# Altium schematic sheet Schematic.SchDoc
size C
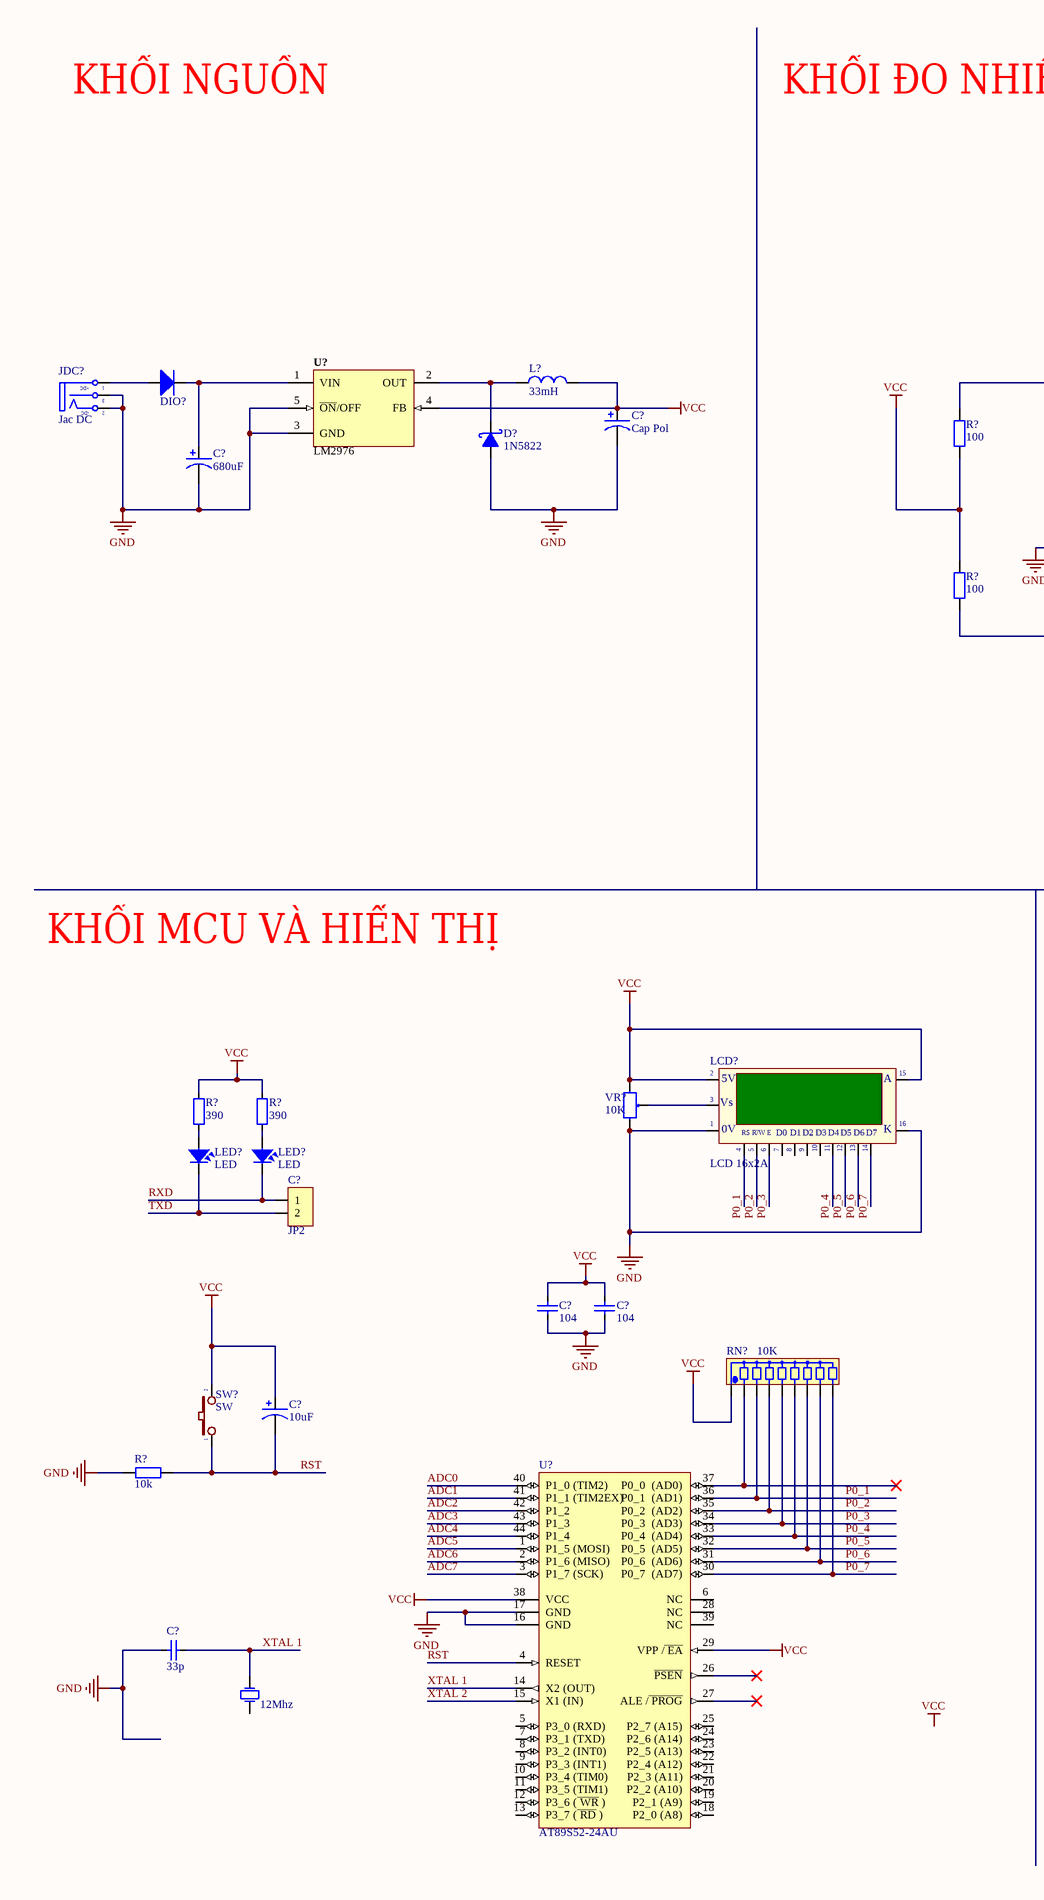
[diagram p0: Schematic.SchDoc, left]
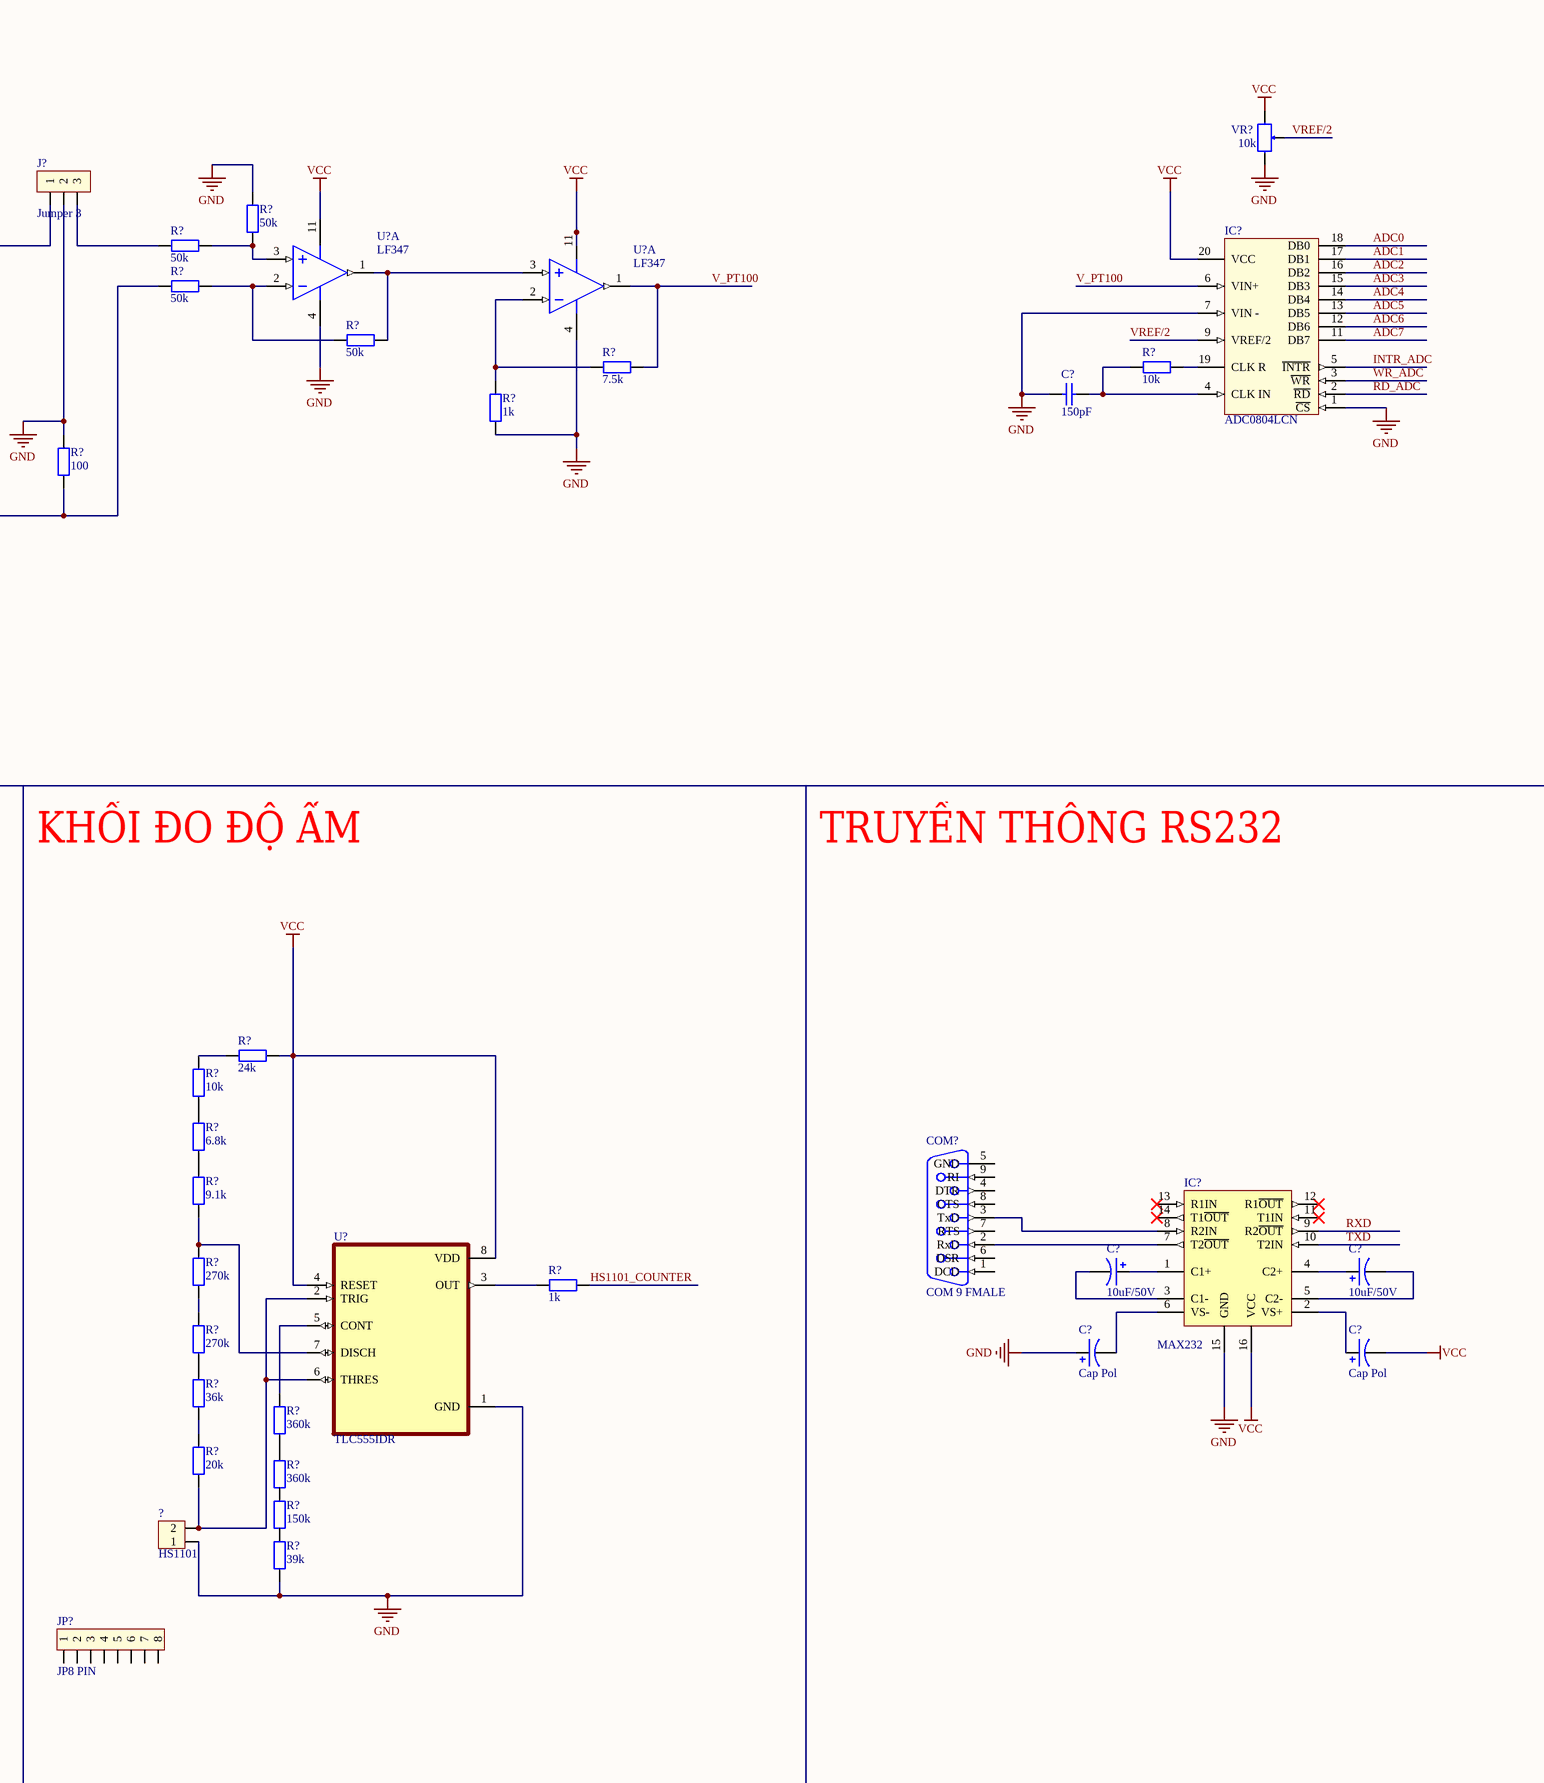
[diagram p1: Schematic.SchDoc, right]

## Parts
(Parts that share a designator on the sheet are numbered #1, #2 ... from top to bottom, then left to right.)
?  HS1101  [CON2]
C?#1  Cap Pol  [C3MM]
C?#2  680uF  [C3MM]
C?#3  150pF  [tu 0805]
C?#4  JP2  [JP2-C1T]
C?#5  104  [CAP_0805]
C?#6  104  [CAP_0805]
C?#7  10uF/50V  [C3MM]
C?#8  10uF/50V  [C3MM]
C?#9  10uF  [C3MM]
C?#10  Cap Pol  [C3MM]
C?#11  Cap Pol  [C3MM]
C?#12  33p  [CAP_0402]
COM?  COM 9 FMALE  [COM9B]
D?  1N5822  [SMA]
DIO?  Diode SMD  [DIO-SMD-106]  (value not drawn)
IC?#1  ADC0804LCN  [DIP20/W0.3]
IC?#2  MAX232  [DIP16/W0.3]
J?  Jumper 3  [JP3]
JDC?  Jac DC  [DC-IN]
JP?  JP8 PIN  [JP8]
L?  33mH  [L-SMD-M-12x10]
LCD?  LCD 16x2A  [LCD16X2]
LED?#1  LED  [LED-0805-Blue]
LED?#2  LED  [LED-0805-Green]
R?#1  50k  [Tro SMD 0805]
R?#2  50k  [Tro SMD 0805]
R?#3  50k  [Tro SMD 0805]
R?#4  100  [Tro SMD 0805]
R?#5  50k  [Tro SMD 0805]
R?#6  7.5k  [Tro SMD 0805]
R?#7  10k  [tro smd 0805]
R?#8  1k  [Tro SMD 0805]
R?#9  100  [Tro SMD 0805]
R?#10  100  [Tro SMD 0805]
R?#11  390  [RES-SMD-0805]
R?#12  390  [RES-SMD-0805]
R?#13  24k  [RES-SMD-0101]
R?#14  10k  [RES-SMD-0101]
R?#15  6.8k  [RES-SMD-0101]
R?#16  9.1k  [RES-SMD-0101]
R?#17  270k  [RES-SMD-0101]
R?#18  1k  [tro smd 0805]
R?#19  270k  [RES-SMD-0101]
R?#20  36k  [Tro SMD 0805]
R?#21  10k  [RES-SMD-0101]
R?#22  360k  [tro smd 0805]
R?#23  20k  [RES-SMD-0101]
R?#24  360k  [RES-SMD-0101]
R?#25  150k  [RES-SMD-0101]
R?#26  39k  [RES-SMD-0101]
RN?  10K  [RN8]
SW?  SW  [SW2]
U?#1  LM2976  [TO263]
U?#2  LF347  [DIP.100/8/W.300/L.400]  (part A of 4)
U?#3  LF347  [DIP.100/8/W.300/L.400]  (part A of 4)
U?#4  TLC555IDR  [SOIC127P599X175-8N]
U?#5  AT89S52-24AU  [TQFP44-0.8-9.6X9.6MM]
VR?#1  10k  [VAR_RESISTOR]
VR?#2  10K  [VR]
Y?  12Mhz  [XTAL]

## Nets
GND: ?.1 C?#1.2 C?#2.2 C?#3.2 C?#5.1 C?#6.1 C?#10.1 C?#12.2 D?.1(A) IC?#1.1(~{CS}) IC?#1.7(VIN_-) IC?#1.8(AGND) IC?#1.10(DGND) IC?#2.15(GND) J?.2 JDC?.2(TN) JDC?.3(S) LCD?.1(GND) LCD?.16(K) R?#1.2 R?#8.1 R?#10.2 R?#21.1 R?#26.2 U?#1.3(GND) U?#1.5(~{ON}/OFF) U?#2.4(VCC) U?#3.4(VCC) U?#4.1(GND) U?#5.16(GND) U?#5.17(GND) VR?#1.3 VR?#2.3
VCC: C?#1.1 C?#5.2 C?#6.2 C?#9.1 C?#11.2 IC?#1.20(VCC) IC?#2.16(VCC) L?.2 LCD?.2(VDD) LCD?.15(A) R?#4.1 R?#9.2 R?#11.2 R?#12.2 R?#13.1 RN?.1 SW?.2 U?#1.4(FB) U?#2.11(VEE) U?#3.11(VEE) U?#4.4(RESET) U?#4.8(VDD) U?#5.29(VPP_/~{_EA}) U?#5.38(VCC) VR?#1.1 VR?#2.1
ADC0: IC?#1.18(DB0) U?#5.40(P1_0_(TIM2))
ADC1: IC?#1.17(DB1) U?#5.41(P1_1_(TIM2EX))
ADC2: IC?#1.16(DB2) U?#5.42(P1_2)
ADC3: IC?#1.15(DB3) U?#5.43(P1_3)
ADC4: IC?#1.14(DB4) U?#5.44(P1_4)
ADC5: IC?#1.13(DB5) U?#5.1(P1_5_(MOSI))
ADC6: IC?#1.12(DB6) U?#5.2(P1_6_(MISO))
ADC7: IC?#1.11(DB7) U?#5.3(P1_7_(SCK))
HS1101_COUNTER: R?#18.2
INTR_ADC: IC?#1.5(~{INTR})
P0_1: RN?.3 U?#5.36(P0_1__(AD1))
P0_2: RN?.4 U?#5.35(P0_2__(AD2))
P0_3: RN?.5 U?#5.34(P0_3__(AD3))
P0_4: RN?.6 U?#5.33(P0_4__(AD4))
P0_5: RN?.7 U?#5.32(P0_5__(AD5))
P0_6: RN?.8 U?#5.31(P0_6__(AD6))
P0_7: RN?.9 U?#5.30(P0_7__(AD7))
RD_ADC: IC?#1.2(~{RD})
RST: C?#9.2 R?#21.2 SW?.1 U?#5.4(RESET)
RXD: C?#4.1 IC?#2.9(R2~{OUT}) LED?#2.2
TXD: C?#4.2 IC?#2.10(T2IN) LED?#1.2
V_PT100: IC?#1.6(VIN+) R?#6.1 U?#3.1(1_OUT)
VREF/2: IC?#1.9(VREF/2) VR?#1.2
WR_ADC: IC?#1.3(~{WR})
XTAL 1: C?#12.1 U?#5.14(X2_(OUT)) Y?.2(OSC2)
XTAL 2: U?#5.15(X1_(IN))
Net?_2: ?.2 R?#23.2 U?#4.2(TRIG) U?#4.6(THRES)
NetC?#2_1: C?#2.1 DIO?.2(K) U?#1.1(VIN)
NetC?#3_1: C?#3.1 IC?#1.4(CLK_IN) R?#7.1
NetC?#7_1: C?#7.1 IC?#2.1(C1+)
NetC?#7_2: C?#7.2 IC?#2.3(C1-)
NetC?#8_1: C?#8.1 IC?#2.4(C2+)
NetC?#8_2: C?#8.2 IC?#2.5(C2-)
NetC?#10_2: C?#10.2 IC?#2.6(VS-)
NetC?#11_1: C?#11.1 IC?#2.2(VS+)
NetCOM?_2: COM?.2(RxD) IC?#2.7(T2~{OUT})
NetCOM?_3: COM?.3(TxD) IC?#2.8(R2IN)
NetD?_2: D?.2(K) L?.1 U?#1.2(OUT)
NetDIO?_1: DIO?.1(A) JDC?.1(T)
NetIC?#1_19: IC?#1.19(CLK_R) R?#7.2
NetJ?_1: J?.1 R?#4.2
NetJ?_3: J?.3 R?#2.1
NetLCD?_3: LCD?.3(VEE) VR?#2.2
NetLED?#1_1: LED?#1.1 R?#11.1
NetLED?#2_1: LED?#2.1 R?#12.1
NetR?#1_1: R?#1.1 R?#2.2 U?#2.3(1_IN+)
NetR?#3_1: R?#3.1 R?#9.1 R?#10.1
NetR?#3_2: R?#3.2 R?#5.1 U?#2.2(1_IN-)
NetR?#5_2: R?#5.2 U?#2.1(1_OUT) U?#3.3(1_IN+)
NetR?#6_2: R?#6.2 R?#8.2 U?#3.2(1_IN-)
NetR?#13_2: R?#13.2 R?#14.1
NetR?#14_2: R?#14.2 R?#15.1
NetR?#15_2: R?#15.2 R?#16.1
NetR?#16_2: R?#16.2 R?#17.1 U?#4.7(DISCH)
NetR?#17_2: R?#17.2 R?#19.1
NetR?#18_1: R?#18.1 U?#4.3(OUT)
NetR?#19_2: R?#19.2 R?#20.2
NetR?#20_1: R?#20.1 R?#23.1
NetR?#22_1: R?#22.1 R?#24.1
NetR?#22_2: R?#22.2 U?#4.5(CONT)
NetRN?_2: RN?.2 U?#5.37(P0_0__(AD0))

Not connected (* = marked no-connect by the designer): COM? 1(DCD) 4(DTR) 5(GND) 6(DSR) 7(RTS) 8(CTS) 9(RI) 10(MH1) 11(MH2); IC?#2 11(T1IN)* 12(R1~{OUT})* 13(R1IN)* 14(T1~{OUT})*; JP? 1 2 3 4 5 6 7 8; LCD? 4(RS) 5(R/~{W}) 6(~{EN}) 7(D0) 8(D1) 9(D2) 10(D3) 11(D4) 12(D5) 13(D6) 14(D7); R?#24 2; R?#25 1 2; R?#26 1; U?#5 5(P3_0_(RXD)) 6(NC) 7(P3_1_(TXD)) 8(P3_2_(INT0)) 9(P3_3_(INT1)) 10(P3_4_(TIM0)) 11(P3_5_(TIM1)) 12(P3_6_(~{_WR}_)) 13(P3_7_(~{_RD}_)) 18(P2_0_(A8)) 19(P2_1_(A9)) 20(P2_2_(A10)) 21(P2_3_(A11)) 22(P2_4_(A12)) 23(P2_5_(A13)) 24(P2_6_(A14)) 25(P2_7_(A15)) 26(~{PSEN})* 27(ALE_/~{_PROG})* 28(NC) 39(NC); Y? 1(OSC1)

## Notes on the sheet
- KHỐI NGUỒN
- KHỐI ĐO NHIỆT ĐỘ
- KHỐI MCU VÀ HIỂN THỊ
- KHỐI ĐO ĐỘ ẨM
- TRUYỀN THÔNG RS232
- Labels drawn without touching a wire or pin: P0_1, P0_2, P0_3, P0_4, P0_5, P0_6, P0_7, VCC
- (in symbol DCIN) +DC; -DC
- (in symbol LCD16x2A) 5V; Vs; |; 0V; R/W; E

## Library data of the parts
? = Con2: Connector 2; Value: Connector 2
C?#1 C?#2 C?#7-C?#11 = Cap Pol: Polarized Capacitor (Axial); Published: 8-Jun-2000; LatestRevisionDate: 17-Jul-2002; LatestRevisionNote: Re-released for DXP Platform.; PackageReference: POLAR0.8; Publisher: Altium Limited
C?#3 = Tu 0805 220nF 50V 10%: Dán; Don_Vi: Con; So_Chan: 2; Ten_Linh_Kien: Tụ 0805 220nF 50V 10%; Ma_Hang: MH008099; Chung_Loai: Dán; Kieu_Chan: *
C?#4 = JP2: WR-PHD 2.54 mm Angled Socket Header; Manufacturer: W¨¹rth Elektronik eiSos GmbH; partNo: 613002143121; ComponentLink1 Description: Manufacturer; ComponentLink2 Description: Datasheet; NoPins: 02; Created Date: 29 March 2013; ComponentLink1URL: http://www.we-online.com; ComponentLink2URL: http://katalog.we-online.de/em/datasheet/6130xx143121.pdf; Created by: Karrer Zheng
C?#5 C?#6 = CapSMD: Capacitor; Value: 33p; Published: 8-Jun-2000; LatestRevisionDate: 17-Jul-2002; LatestRevisionNote: Re-released for DXP Platform.; PackageReference: RAD-0.3; Publisher: Altium Limited
C?#12 = CapSMD: Capacitor; Published: 8-Jun-2000; LatestRevisionDate: 17-Jul-2002; LatestRevisionNote: Re-released for DXP Platform.; PackageReference: RAD-0.3; Publisher: Altium Limited; Value: 33p
COM? = COM9F: COM 9; PackageDocument: O; Positions: 9; Gender: Receptacle; Value: COM 9; Published: 15-Jun-2001; LatestRevisionDate: 17-Jul-2002; LatestRevisionNote: Re-released for DXP Platform.; DatasheetDocument: 1-Sep-1999; PackageReference: 788750; Publisher: Altium Limited; Orientation: Right Angle
D? = 1N5822: Schottky Rectifiers; Value: Diode c?m 1N5408
DIO? = Diode SMD: Default Diode; Code - JEDEC: DO-214-AB; Value: 1N5007; Published: 8-Jun-2000; Revision: July-2002: Re-released for DXP Platform.; Publisher: Altium Limited
IC?#1 = ADC0804: Cắm; Ten_Linh_Kien: ADC0804LCN DIP20; Don_Vi: Con; Ma_Hang: MH002626; Ghi_Chu: *; Kieu_Chan: *; Chung_Loai: Cắm
IC?#2 = MAX232: Dual EIA-232 Driver/Receiver; Value: MAX232
J? = JP3: Value: J3
JDC? = DCIN: Jac DC input; Value: Jac DC
JP? = JP8: Value: JP7
L? = Inductor: Value: 150 mH
LCD? = LCD16x2A: LCD dipslay 16 char, 2 line; Value: LCD16x2A
LED?#1 LED?#2 = LED: LED Single colour Green and Red; Value: LED 3 ly Single Colour
R?#1-R?#6 R?#8-R?#10 = Tro 0805 5% 82k: Dán; Don_Vi: Con; So_Chan: 2; Ten_Linh_Kien: Trở 0805 5% 82k; Ma_Hang: MH005329; Chung_Loai: Dán; Kieu_Chan: *
R?#7 = Tro 0805 5% 10k: Dán; Don_Vi: Con; So_Chan: 2; Ten_Linh_Kien: Trở 0805 5% 10k; Ma_Hang: MH005239; Chung_Loai: Dán; Kieu_Chan: *
R?#11 R?#12 = Resistor - SMD: Resistor; Manufacturer: Generic Components; Class: Passive; Published: 08/06/2000; Publisher: Altium Hobart Technology Centre
R?#13-R?#17 R?#19 R?#21 R?#23-R?#26 = Resistor - SMD: Resistor SMD; Manufacturer: Generic Components; Class: Passive; Published: 08/06/2000; Publisher: Altium Hobart Technology Centre
R?#18 = Tro 0805 1% 1k: Dán; Don_Vi: Con; So_Chan: 2; Ten_Linh_Kien: Trở 0805 1% 1k; Ma_Hang: MH005468; Chung_Loai: Dán; Kieu_Chan: *
R?#20 = Tro 0805 5% 510k: Dán; Don_Vi: Con; Ma_Hang: MH007566; Ten_Linh_Kien: Trở 0805 5% 510k; So_Chan: 2; Chung_Loai: Dán; Kieu_Chan: *
R?#22 = Tro 0805 5% 1M: Dán; Don_Vi: Con; So_Chan: 2; Ten_Linh_Kien: Trở 0805 5% 1M; Ma_Hang: MH005235; Chung_Loai: Dán; Kieu_Chan: *
RN? = RN8: Resistor 8 (Thanh); Value: Tro thanh 10K
SW? = SW2: Switch button 2 pin; Value: SW chip 2 pin
U?#1 = LM2596: Max Input Voltage: 12 V; Max Output Current: 3 (6.0 peak) A; Max Output Voltage: mV; Category: IC-Power; Min Input Voltage: mV; Min Output Voltage: mV; Mounting Technology: Surface Mount; Status: Unreleased; Supply Voltage: mV; Temperature Range: -40 to +125 degC
U?#2 U?#3 = LF347: Low Power Quad Operational Amplifier; Manufacturer Part Number: LF347BD; Manufacturer: Texas Instruments; Text Field1: pristel=Nsc\nsanopea\<parttype>.ckt; Slew Rate: 13 V/µs; Voltage - Supply, Single/Dual (±): 7 V ~ 36 V, ±3.5 V ~ 18 V; Current - Input Bias: 50pA; Voltage - Input Offset: 3000µV; Number of Circuits: 4; Gain Bandwidth Product: 3MHz; Amplifier Type: J-FET; Current - Supply: 8mA; Supplier 1: Digi-Key; Supplier Part Number 1: 296-7136-5-ND; Package / Case: 14-SOIC (3.9mm Width), 14-SOL; Supplier: Digi-Key; Current - Output / Channel: -; Packaging: Tube; RoHS: RoHS Compliant; Output Type: -; Operating Temperature: 0°C ~ 70°C; Category: Integrated Circuits (ICs); Supplier Part Number: 296-7136-5-ND
U?#4 = TLC555IDR: 2.1-MHz, 250-A, Low-Power Timer 8-SOIC -40 to 85; MF: Texas Instruments; Purchase-URL: https://pricing.snapeda.com/search/part/TLC555IDR/?ref=eda; MP: TLC555IDR; Package: SOIC-8 Texas Instruments; Value: *; Price: None; SnapEDA_Link: https://www.snapeda.com/parts/TLC555IDR/Texas%20Instruments/view-part/46238/?ref=snap; Availability: Good
U?#5 = AT89S52-24AU: Atmel 8 Bit Micro 4.0-5.5V 24MHz -40 to +80 Deg C 44TQFP (44A) Package GREEN OPTION; GREEN OPTION: YES; Vendor: ATMEL; PartNr: AT89S52-24AU; Package: 44A 44-lead, Thin Plastic Gull Wing Quad Flatpack (TQFP)
VR?#1 VR?#2 = VR: Var Resistor; Value: VR 10K
Y? = XTAL: Crystal Oscillator; Published: 8-Jun-2000; LatestRevisionDate: 17-Jul-2002; LatestRevisionNote: Re-released for DXP Platform.; PackageReference: R38; Publisher: Altium Limited